# Altium schematic sheet 09_PL_ETH_2.SchDoc
size A3
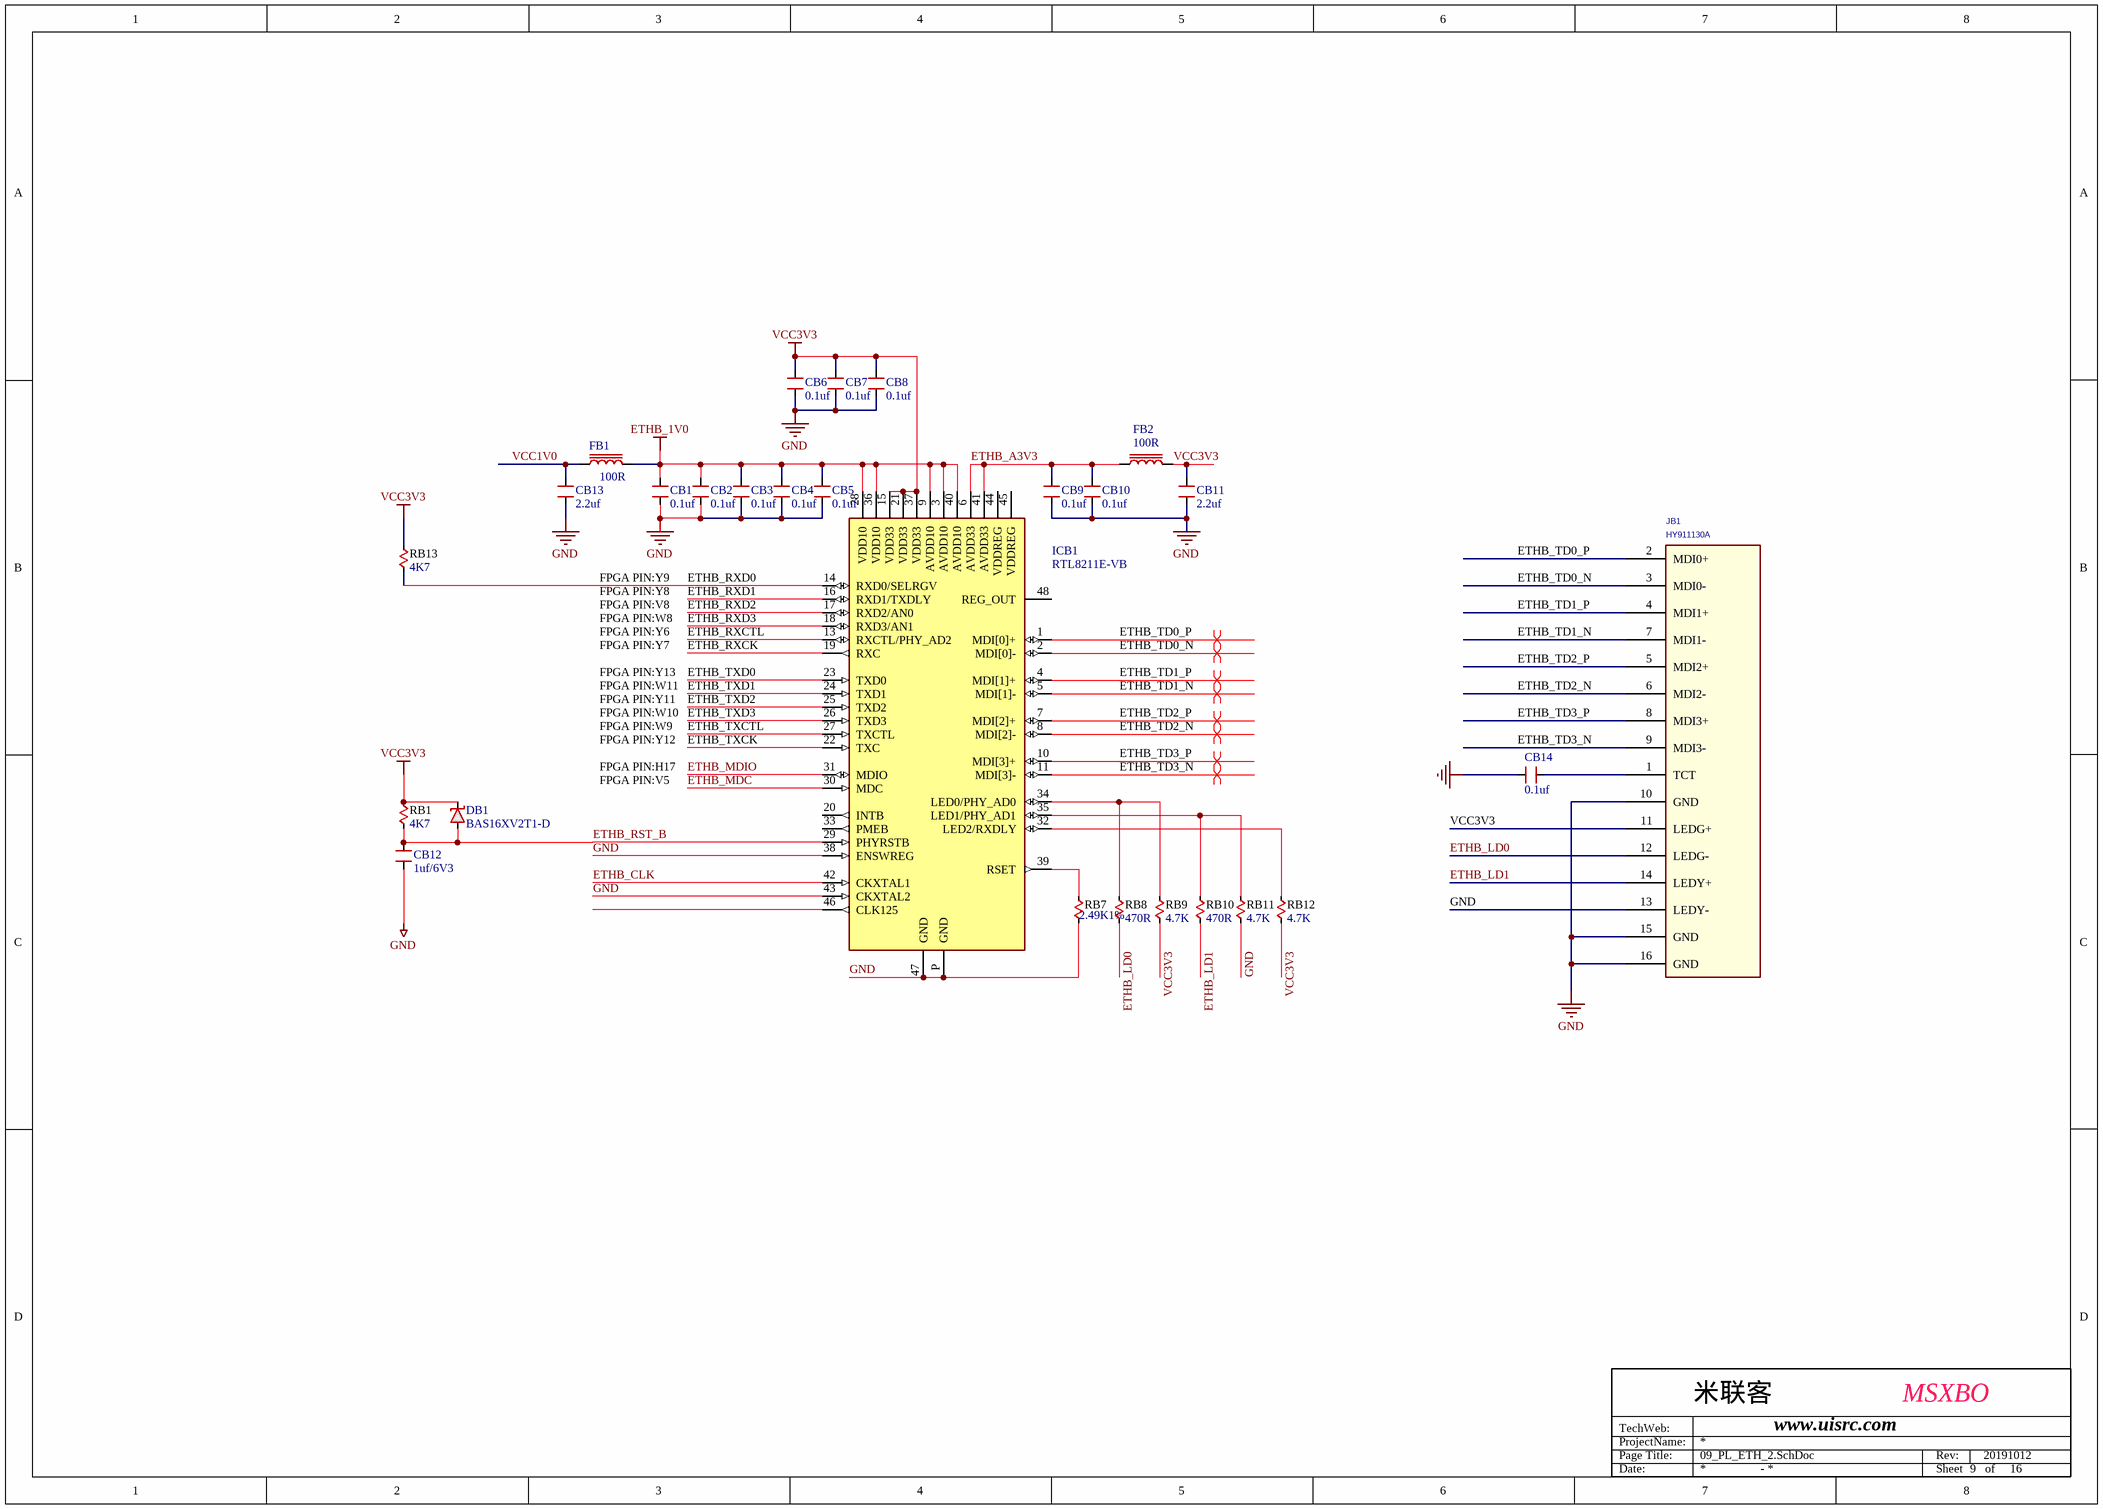
[diagram p0: 09_PL_ETH_2.SchDoc]

## Parts
CB1  0.1uf  [CAP0402]
CB2  0.1uf  [CAP0402]
CB3  0.1uf  [CAP0402]
CB4  0.1uf  [CAP0402]
CB5  0.1uf  [CAP0402]
CB6  0.1uf  [CAP0402]
CB7  0.1uf  [CAP0402]
CB8  0.1uf  [CAP0402]
CB9  0.1uf  [CAP0402]
CB10  0.1uf  [CAP0402]
CB11  2.2uf  [CAP0402]
CB12  1uf/6V3  [CAP0402]
CB13  2.2uf  [CAP0402]
CB14  0.1uf  [CAP0402]
DB1  BAS16XV2T1-D  [SOD-523]
FB1  100R  [CAP0603]
FB2  100R  [CAP0603]
ICB1  RTL8211E-VB  [QFN48]
JB1  HY911130A  [HY911130A]
RB1  4K7  [RES0402]
RB7  2.49K1%  [RES0402]
RB8  470R  [RES0402]
RB9  4.7K  [RES0402]
RB10  470R  [RES0402]
RB11  4.7K  [RES0402]
RB12  4.7K  [RES0402]
RB13  4K7  [RES0402]

## Nets
ETHB_1V0: CB1.1 CB2.1 CB3.1 CB4.1 CB5.1 FB1.2 ICB1.3(AVDD10) ICB1.9(AVDD10) ICB1.28(VDD10) ICB1.36(VDD10) ICB1.40(AVDD10)
GND: CB1.2 CB2.2 CB3.2 CB4.2 CB5.2 CB6.2 CB7.2 CB8.2 CB9.2 CB10.2 CB11.2 CB12.2 CB13.2 CB14.1 ICB1.38(ENSWREG) ICB1.43(CKXTAL2) ICB1.47(GND) ICB1.P(GND) JB1.10(GND) JB1.13(LEDY-) JB1.15(GND) JB1.16(GND) RB7.2 RB11.2
VCC3V3: CB6.1 CB7.1 CB8.1 CB11.1 DB1.K FB2.2 ICB1.15(VDD33) ICB1.21(VDD33) ICB1.37(VDD33) JB1.11(LEDG+) RB1.1 RB9.2 RB12.2 RB13.1
ETHB_A3V3: CB9.1 CB10.1 FB2.1 ICB1.6(AVDD33) ICB1.41(AVDD33)
ETHB_CLK: ICB1.42(CKXTAL1)
ETHB_LD0: JB1.12(LEDG-) RB8.2
ETHB_LD1: JB1.14(LEDY+) RB10.2
ETHB_MDC: ICB1.30(MDC)
ETHB_MDIO: ICB1.31(MDIO)
ETHB_RST_B: CB12.1 DB1.A ICB1.29(PHYRSTB) RB1.2
ETHB_RXCK: ICB1.19(RXC)
ETHB_RXCTL: ICB1.13(RXCTL/PHY_AD2)
ETHB_RXD0: ICB1.14(RXD0/SELRGV) RB13.2
ETHB_RXD1: ICB1.16(RXD1/TXDLY)
ETHB_RXD2: ICB1.17(RXD2/AN0)
ETHB_RXD3: ICB1.18(RXD3/AN1)
ETHB_TD0_N: ICB1.2(MDI[0]-) JB1.3(MDI0-)
ETHB_TD0_P: ICB1.1(MDI[0]+) JB1.2(MDI0+)
ETHB_TD1_N: ICB1.5(MDI[1]-) JB1.7(MDI1-)
ETHB_TD1_P: ICB1.4(MDI[1]+) JB1.4(MDI1+)
ETHB_TD2_N: ICB1.8(MDI[2]-) JB1.6(MDI2-)
ETHB_TD2_P: ICB1.7(MDI[2]+) JB1.5(MDI2+)
ETHB_TD3_N: ICB1.11(MDI[3]-) JB1.9(MDI3-)
ETHB_TD3_P: ICB1.10(MDI[3]+) JB1.8(MDI3+)
ETHB_TXCK: ICB1.22(TXC)
ETHB_TXCTL: ICB1.27(TXCTL)
ETHB_TXD0: ICB1.23(TXD0)
ETHB_TXD1: ICB1.24(TXD1)
ETHB_TXD2: ICB1.25(TXD2)
ETHB_TXD3: ICB1.26(TXD3)
VCC1V0: CB13.1 FB1.1
NetCB14_2: CB14.2 JB1.1(TCT)
NetICB1_32: ICB1.32(LED2/RXDLY) RB12.1
NetICB1_34: ICB1.34(LED0/PHY_AD0) RB8.1 RB9.1
NetICB1_35: ICB1.35(LED1/PHY_AD1) RB10.1 RB11.1
NetICB1_39: ICB1.39(RSET) RB7.1

Not connected (* = marked no-connect by the designer): ICB1 20(INTB) 33(PMEB) 44(VDDREG) 45(VDDREG) 46(CLK125) 48(REG_OUT)

## Layout directives
differential pair: ETHB_TD0_N, ETHB_TD0_P, ETHB_TD1_N, ETHB_TD1_P, ETHB_TD2_N, ETHB_TD2_P, ETHB_TD3_N, ETHB_TD3_P

## Notes on the sheet
- FPGA PIN:Y9
- FPGA PIN:Y8
- FPGA PIN:V8
- FPGA PIN:W8
- FPGA PIN:Y6
- FPGA PIN:Y7
- FPGA PIN:Y13
- FPGA PIN:W11
- FPGA PIN:Y11
- FPGA PIN:W10
- FPGA PIN:W9
- FPGA PIN:Y12
- FPGA PIN:H17
- FPGA PIN:V5
- ProjectName:
- TechWeb:
- Page Title:
- 米联客
- www.uisrc.com
- MSXBO
- Rev:
- 20191012
- Date:
- -
- Sheet
- 9   of     16

## Library data of the parts
CB1-CB11 CB13 CB14 = CAPACITOR: Generic Capacitor; DPN: *; Manufacturer: *
CB12 = CAPACITOR: Generic Capacitor; Manufacturer: Murata; Value: 47uF; DPN: *
DB1 = DIODE-SCH: Surface Mount ESD Protection Diode; Manufacturer: On Semiconductor; DPN: *
FB1 FB2 = Ferrite Bead: Generic Ferrite Bead; Value: 220; DPN: *; Manufacturer: *
ICB1 = RTL8211E-VL
RB1 RB7-RB13 = RESISTOR: Generic Resistor; Value: 390; Manufacturer: *; DPN: *